# EAGLE schematic projet_electronique (EAGLE 7.2.0)
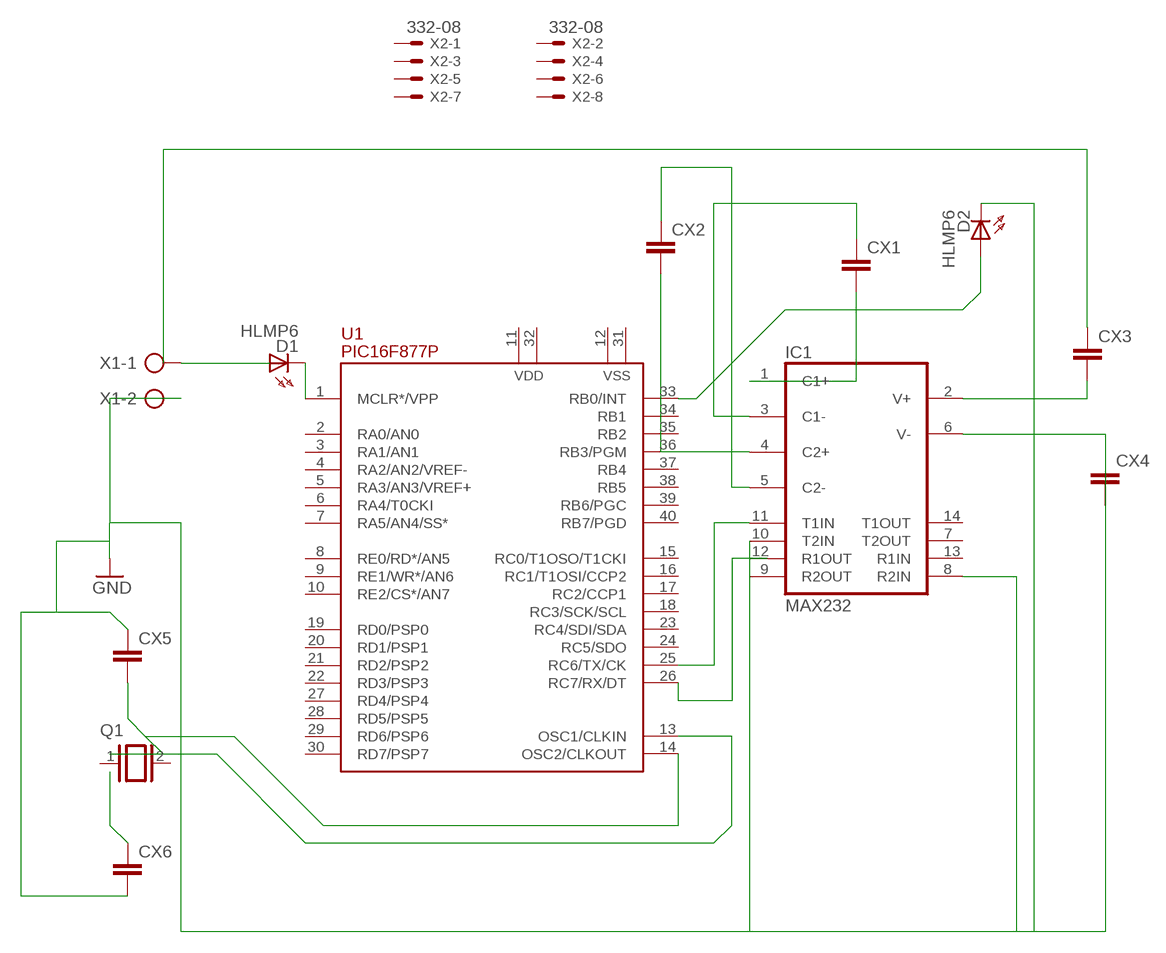
[diagram p0: schematic, sheet 1]

## Parts
CX1  CXXC10B5  [XC10B5]
CX2  CXXC10B5  [XC10B5]
CX3  CXXC10B5  [XC10B5]
CX4  CXXC10B5  [XC10B5]
CX5  CXXC10B5  [XC10B5]
CX6  CXXC10B5  [XC10B5]
D1  HLMP6  [HLMP6]
D2  HLMP6  [HLMP6]
IC1  MAX232  [DIL16]
Q1  XTAL  [Q]
U1  PIC16F877P  [DIL40]
X1  AK500/2-H  [AK500/2-H]
X2  332-08  [332-08]

## Nets
GND: CX4.1 CX4.2 CX5.1 CX6.2 D2.K IC1.6(V-) IC1.8(R2IN) IC1.10(T2IN) X1.2
N$1: D1.K U1.1(MCLR*/VPP)
N$2: CX1.2 IC1.1(C1+)
N$3: CX1.1 IC1.3(C1-)
N$4: CX2.2 IC1.4(C2+)
N$5: CX2.1 IC1.5(C2-)
N$6: CX3.2 IC1.2(V+)
N$7: CX3.1
N$8: CX6.1
N$9: IC1.11(T1IN) U1.25(RC6/TX/CK)
N$10: U1.26(RC7/RX/DT)
N$11: D2.A U1.33(RB0/INT)
N$12: CX5.2 U1.13(OSC1/CLKIN) U1.14(OSC2/CLKOUT)
N$13: X1.1
Unconnected: D1.A IC1.7(T2OUT) IC1.9(R2OUT) IC1.12(R1OUT) IC1.13(R1IN) IC1.14(T1OUT) Q1.1 Q1.2 U1.2(RA0/AN0) U1.3(RA1/AN1) U1.4(RA2/AN2/VREF-) U1.5(RA3/AN3/VREF+) U1.6(RA4/T0CKI) U1.7(RA5/AN4/SS*) U1.8(RE0/RD*/AN5) U1.9(RE1/WR*/AN6) U1.10(RE2/CS*/AN7) U1.11(VDD) U1.12(VSS) U1.15(RC0/T1OSO/T1CKI) U1.16(RC1/T1OSI/CCP2) U1.17(RC2/CCP1) U1.18(RC3/SCK/SCL) U1.19(RD0/PSP0) U1.20(RD1/PSP1) U1.21(RD2/PSP2) U1.22(RD3/PSP3) U1.23(RC4/SDI/SDA) U1.24(RC5/SDO) U1.27(RD4/PSP4) U1.28(RD5/PSP5) U1.29(RD6/PSP6) U1.30(RD7/PSP7) U1.31(VSS) U1.32(VDD) U1.34(RB1) U1.35(RB2) U1.36(RB3/PGM) U1.37(RB4) U1.38(RB5) U1.39(RB6/PGC) U1.40(RB7/PGD) X2.1 X2.2 X2.3 X2.4 X2.5 X2.6 X2.7 X2.8

## Power pins joined to a net without a drawn wire
GND: IC1.15(GND)
VCC: IC1.16(VCC)

## Library data of the parts
CX1-CX6 = rcl:CX: X CAPACITOR for power line
D1 D2 = display-hp:HLMP6: LED 2mm horizontal; MF: AGILENT TECHNOLOGIES; MPN: HLMP-6500; OC_FARNELL: 1652490; OC_NEWARK: 40K0088
IC1 = maxim:MAX232: RS232 TRANSCEIVER; MF: MAXIM; MPN: MAX232ACPE+; OC_FARNELL: 9723773; OC_NEWARK: 68K4544
Q1 = special:XTAL: CRYSTAL
U1 = pic16f87x:PIC16F877: FLASH MICROCONTROLLER
X1 = con-ptr500:AK500/2-H: CONNECTOR Aug. 2004 / PTR Meßtechnik: Die Bezeichnung der Serie AK505 wurde geändert. Es handelt sich hierbei um AK500 in horizontaler Ausführung.; OC_FARNELL: unknown; OC_NEWARK: unknown
X2 = con-garry:332-08: 8 Pin - 2mm Dual Row Source: www.mpe-connector.de / garry_shortform_2012.pdf